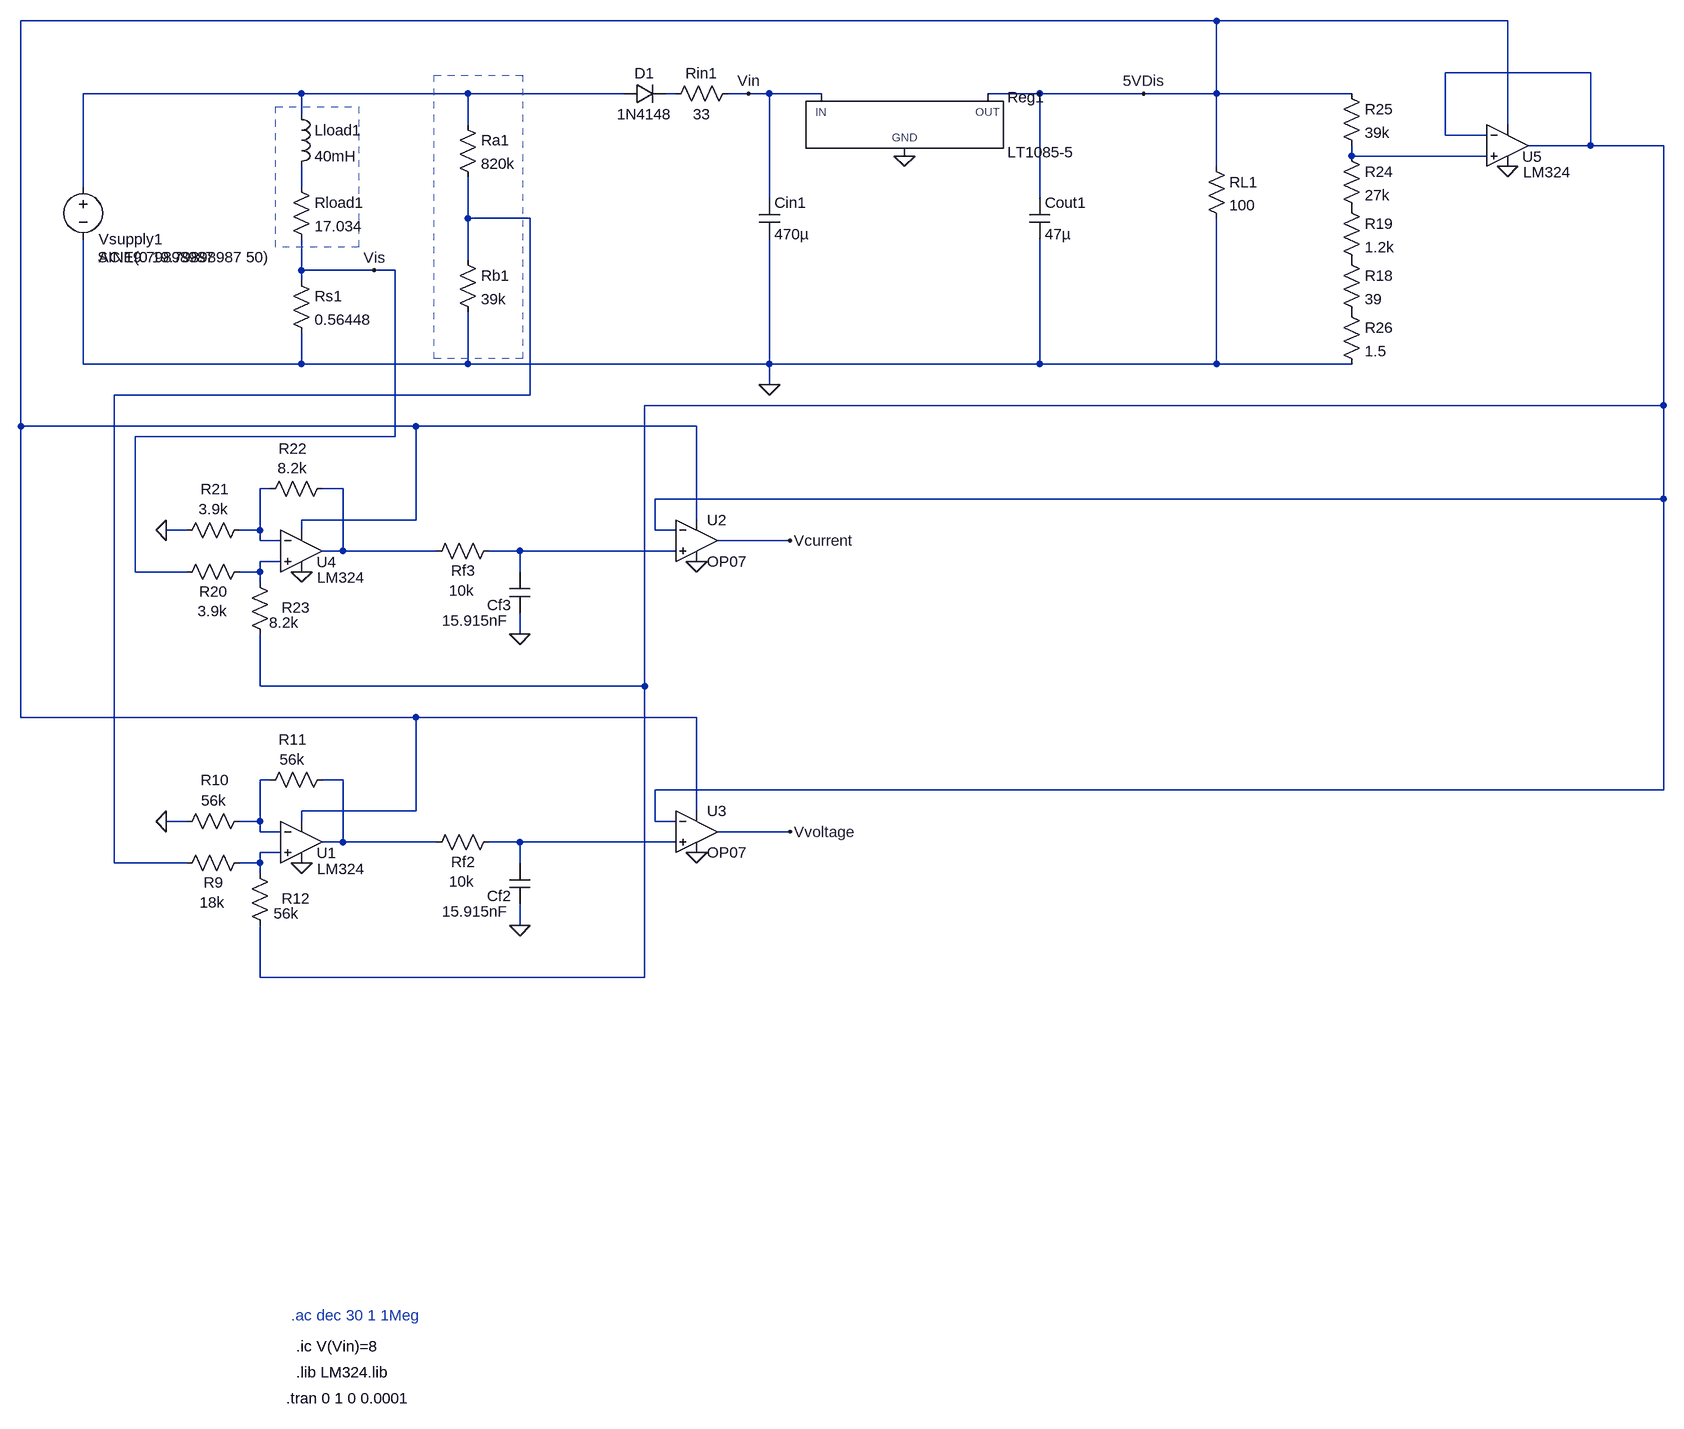
[diagram p0: schematic LT Spice Final schematic.asc]
LT Spice Final schematic.asc, the LTspice schematic file:
Version 4
SHEET 1 3988 1652
WIRE -192 -1008 -2032 -1008
WIRE 256 -1008 -192 -1008
WIRE 384 -928 160 -928
WIRE -1600 -896 -1936 -896
WIRE -1344 -896 -1600 -896
WIRE -1104 -896 -1344 -896
WIRE -1024 -896 -1040 -896
WIRE -912 -896 -944 -896
WIRE -880 -896 -912 -896
WIRE -800 -896 -880 -896
WIRE -464 -896 -544 -896
WIRE -304 -896 -464 -896
WIRE -192 -896 -192 -1008
WIRE -192 -896 -304 -896
WIRE 16 -896 -192 -896
WIRE -1600 -864 -1600 -896
WIRE -1344 -848 -1344 -896
WIRE 256 -848 256 -1008
WIRE 160 -832 160 -928
WIRE 224 -832 160 -832
WIRE 384 -816 384 -928
WIRE 384 -816 288 -816
WIRE 496 -816 384 -816
WIRE 16 -800 16 -816
WIRE 224 -800 16 -800
WIRE -192 -784 -192 -896
WIRE -1936 -752 -1936 -896
WIRE -1600 -752 -1600 -784
WIRE -880 -736 -880 -896
WIRE -464 -736 -464 -896
WIRE -1344 -704 -1344 -768
WIRE -1248 -704 -1344 -704
WIRE -1344 -640 -1344 -704
WIRE -1600 -624 -1600 -672
WIRE -1488 -624 -1600 -624
WIRE -1456 -624 -1488 -624
WIRE -1600 -608 -1600 -624
WIRE -1936 -480 -1936 -672
WIRE -1600 -480 -1600 -528
WIRE -1600 -480 -1936 -480
WIRE -1344 -480 -1344 -560
WIRE -1344 -480 -1600 -480
WIRE -880 -480 -880 -672
WIRE -880 -480 -1344 -480
WIRE -464 -480 -464 -672
WIRE -464 -480 -880 -480
WIRE -192 -480 -192 -704
WIRE -192 -480 -464 -480
WIRE 16 -480 -192 -480
WIRE -880 -448 -880 -480
WIRE -1248 -432 -1248 -704
WIRE -1248 -432 -1888 -432
WIRE 496 -416 496 -816
WIRE 496 -416 -1072 -416
WIRE -2032 -384 -2032 -1008
WIRE -1424 -384 -2032 -384
WIRE -992 -384 -1424 -384
WIRE -1456 -368 -1456 -624
WIRE -1456 -368 -1856 -368
WIRE -1648 -288 -1664 -288
WIRE -1536 -288 -1568 -288
WIRE 496 -272 496 -416
WIRE 496 -272 -1056 -272
WIRE -1424 -240 -1424 -384
WIRE -1424 -240 -1600 -240
WIRE -992 -240 -992 -384
WIRE -1776 -224 -1808 -224
WIRE -1664 -224 -1664 -288
WIRE -1664 -224 -1696 -224
WIRE -1600 -224 -1600 -240
WIRE -1056 -224 -1056 -272
WIRE -1024 -224 -1056 -224
WIRE -1664 -208 -1664 -224
WIRE -1632 -208 -1664 -208
WIRE -848 -208 -960 -208
WIRE -1536 -192 -1536 -288
WIRE -1536 -192 -1568 -192
WIRE -1392 -192 -1536 -192
WIRE -1264 -192 -1312 -192
WIRE -1024 -192 -1264 -192
WIRE -1632 -176 -1664 -176
WIRE -1856 -160 -1856 -368
WIRE -1776 -160 -1856 -160
WIRE -1664 -160 -1664 -176
WIRE -1664 -160 -1696 -160
WIRE -1264 -160 -1264 -192
WIRE -1664 -144 -1664 -160
WIRE -1264 -64 -1264 -96
WIRE -1664 16 -1664 -64
WIRE -1072 16 -1072 -416
WIRE -1072 16 -1664 16
WIRE -2032 64 -2032 -384
WIRE -1424 64 -2032 64
WIRE -992 64 -1424 64
WIRE -1648 160 -1664 160
WIRE -1536 160 -1568 160
WIRE 496 176 496 -272
WIRE 496 176 -1056 176
WIRE -1424 208 -1424 64
WIRE -1424 208 -1600 208
WIRE -992 208 -992 64
WIRE -1776 224 -1808 224
WIRE -1664 224 -1664 160
WIRE -1664 224 -1696 224
WIRE -1600 224 -1600 208
WIRE -1056 224 -1056 176
WIRE -1024 224 -1056 224
WIRE -1664 240 -1664 224
WIRE -1632 240 -1664 240
WIRE -848 240 -960 240
WIRE -1536 256 -1536 160
WIRE -1536 256 -1568 256
WIRE -1392 256 -1536 256
WIRE -1264 256 -1312 256
WIRE -1024 256 -1264 256
WIRE -1632 272 -1664 272
WIRE -1888 288 -1888 -432
WIRE -1776 288 -1888 288
WIRE -1664 288 -1664 272
WIRE -1664 288 -1696 288
WIRE -1264 288 -1264 256
WIRE -1664 304 -1664 288
WIRE -1264 384 -1264 352
WIRE -1664 464 -1664 384
WIRE -1072 464 -1072 16
WIRE -1072 464 -1664 464
FLAG -1600 288 0
FLAG -1808 224 0
FLAG -1264 384 0
FLAG -304 -896 5VDis
FLAG -912 -896 Vin
FLAG -1488 -624 Vis
FLAG -1600 -160 0
FLAG -1808 -224 0
FLAG -1264 -64 0
FLAG 256 -784 0
FLAG -880 -448 0
FLAG -672 -800 0
FLAG -992 -176 0
FLAG -992 272 0
FLAG -848 240 Vvoltage
FLAG -848 -208 Vcurrent
SYMBOL Opamps/opamp2 -1600 192 R0
WINDOW 0 23 81 Left 2
WINDOW 3 24 105 Left 2
SYMATTR InstName U1
SYMATTR Value LM324
SYMBOL res -1680 272 R90
WINDOW 0 62 55 VBottom 2
WINDOW 3 61 57 VTop 2
SYMATTR InstName R9
SYMATTR Value 18k
SYMBOL res -1680 208 R90
WINDOW 0 -32 53 VBottom 2
WINDOW 3 -32 55 VTop 2
SYMATTR InstName R10
SYMATTR Value 56k
SYMBOL res -1552 144 R90
WINDOW 0 -30 61 VBottom 2
WINDOW 3 -31 62 VTop 2
SYMATTR InstName R11
SYMATTR Value 56k
SYMBOL res -1648 400 R180
WINDOW 0 -62 57 Left 2
WINDOW 3 -44 34 Left 2
SYMATTR InstName R12
SYMATTR Value 56k
SYMBOL res -1296 240 R90
WINDOW 0 62 55 VBottom 2
WINDOW 3 61 57 VTop 2
SYMATTR InstName Rf2
SYMATTR Value 10k
SYMBOL cap -1248 352 R180
WINDOW 0 29 13 Left 2
WINDOW 3 33 -11 Left 2
SYMATTR InstName Cf2
SYMATTR Value 15.915nF
SYMBOL PowerProducts/LT1085-5 -672 -896 R0
SYMATTR InstName Reg1
SYMBOL res -208 -800 R0
SYMATTR InstName RL1
SYMATTR Value 100
SYMBOL res -928 -912 R90
WINDOW 0 0 56 VBottom 2
WINDOW 3 32 56 VTop 2
SYMATTR InstName Rin1
SYMATTR Value 33
SYMBOL diode -1104 -880 R270
WINDOW 0 32 32 VTop 2
WINDOW 3 0 32 VBottom 2
SYMATTR InstName D1
SYMATTR Value 1N4148
SYMBOL cap -896 -736 R0
SYMATTR InstName Cin1
SYMATTR Value 470µ
SYMATTR SpiceLine Rser=0.001
SYMBOL cap -480 -736 R0
SYMATTR InstName Cout1
SYMATTR Value 47µ
SYMATTR SpiceLine Rser=0.001
SYMBOL voltage -1936 -768 R0
WINDOW 0 24 96 Left 2
WINDOW 3 22 124 Left 2
WINDOW 123 24 124 Left 2
WINDOW 39 0 0 Left 0
SYMATTR InstName Vsupply1
SYMATTR Value SINE(0 19.79898987 50)
SYMATTR Value2 AC 19.79898987
SYMBOL res -1616 -768 R0
SYMATTR InstName Rload1
SYMATTR Value 17.034
SYMBOL ind -1616 -880 R0
SYMATTR InstName Lload1
SYMATTR Value 40mH
SYMBOL res -1616 -624 R0
SYMATTR InstName Rs1
SYMATTR Value 0.56448
SYMBOL res -1360 -864 R0
SYMATTR InstName Ra1
SYMATTR Value 820k
SYMBOL res -1360 -656 R0
SYMATTR InstName Rb1
SYMATTR Value 39k
SYMBOL Opamps/opamp2 -1600 -256 R0
WINDOW 0 23 81 Left 2
WINDOW 3 24 105 Left 2
SYMATTR InstName U4
SYMATTR Value LM324
SYMBOL res -1680 -176 R90
WINDOW 0 62 55 VBottom 2
WINDOW 3 61 57 VTop 2
SYMATTR InstName R20
SYMATTR Value 3.9k
SYMBOL res -1680 -240 R90
WINDOW 0 -32 53 VBottom 2
WINDOW 3 -32 55 VTop 2
SYMATTR InstName R21
SYMATTR Value 3.9k
SYMBOL res -1552 -304 R90
WINDOW 0 -30 61 VBottom 2
WINDOW 3 -31 62 VTop 2
SYMATTR InstName R22
SYMATTR Value 8.2k
SYMBOL res -1648 -48 R180
WINDOW 0 -62 57 Left 2
WINDOW 3 -44 34 Left 2
SYMATTR InstName R23
SYMATTR Value 8.2k
SYMBOL res -1296 -208 R90
WINDOW 0 62 55 VBottom 2
WINDOW 3 61 57 VTop 2
SYMATTR InstName Rf3
SYMATTR Value 10k
SYMBOL cap -1248 -96 R180
WINDOW 0 29 13 Left 2
WINDOW 3 33 -11 Left 2
SYMATTR InstName Cf3
SYMATTR Value 15.915nF
SYMBOL res 0 -656 R0
SYMATTR InstName R18
SYMATTR Value 39
SYMBOL res 0 -736 R0
SYMATTR InstName R19
SYMATTR Value 1.2k
SYMBOL res 0 -816 R0
SYMATTR InstName R24
SYMATTR Value 27k
SYMBOL res 0 -912 R0
SYMATTR InstName R25
SYMATTR Value 39k
SYMBOL res 0 -576 R0
SYMATTR InstName R26
SYMATTR Value 1.5
SYMBOL Opamps/opamp2 256 -880 R0
WINDOW 0 23 81 Left 2
WINDOW 3 24 105 Left 2
SYMATTR InstName U5
SYMATTR Value LM324
SYMBOL OpAmps\\OP07 -992 -272 R0
SYMATTR InstName U2
SYMBOL OpAmps\\OP07 -992 176 R0
SYMATTR InstName U3
TEXT -1624 1112 Left 2 !.tran 0 1 0 0.0001
TEXT -1608 1072 Left 2 !.lib LM324.lib
TEXT -1608 1032 Left 2 !.ic V(Vin)=8
TEXT -1616 984 Left 2 ;.ac dec 30 1 1Meg
RECTANGLE Normal -1640 -876 -1512 -660 2
RECTANGLE Normal -1396 -924 -1260 -488 2

The netlist it stands for:
* LT Spice Final schematic.asc
XU1 N014 N011 5VDis 0 N012 LM324  ; pins In+ In- V+ V- OUT
R9 N014 N006 18k
R10 N011 0 56k
R11 N012 N011 56k
R12 N001 N014 56k
Rf2 N013 N012 10k
Cf2 0 N013 15.915nF
XReg1 0 5VDis Vin LT1085-5  ; pins GND OUT IN
RL1 5VDis 0 100
Rin1 Vin N003 33
D1 N002 N003 1N4148
Cin1 Vin 0 470µ Rser=0.001
Cout1 5VDis 0 47µ Rser=0.001
Vsupply1 N002 0 SINE(0 19.79898987 50) AC 19.79898987
Rload1 N005 Vis 17.034
Lload1 N002 N005 40mH
Rs1 Vis 0 0.56448
Ra1 N002 N006 820k
Rb1 N006 0 39k
XU4 N010 N007 5VDis 0 N008 LM324  ; pins In+ In- V+ V- OUT
R20 N010 Vis 3.9k
R21 N007 0 3.9k
R22 N008 N007 8.2k
R23 N001 N010 8.2k
Rf3 N009 N008 10k
Cf3 0 N009 15.915nF
R18 P001 P002 39
R19 P003 P001 1.2k
R24 N004 P003 27k
R25 5VDis N004 39k
R26 P002 0 1.5
XU5 N004 N001 5VDis 0 N001 LM324  ; pins In+ In- V+ V- OUT
XU2 N009 N001 5VDis 0 Vcurrent LT1001  ; OP07, pins In+ In- V+ V- OUT
XU3 N013 N001 5VDis 0 Vvoltage LT1001  ; OP07, pins In+ In- V+ V- OUT
.model D D
.lib standard.dio
.tran 0 1 0 0.0001
.lib LM324.lib
.ic V(Vin)=8
* .ac dec 30 1 1Meg
.lib LTC.lib
.backanno
.end